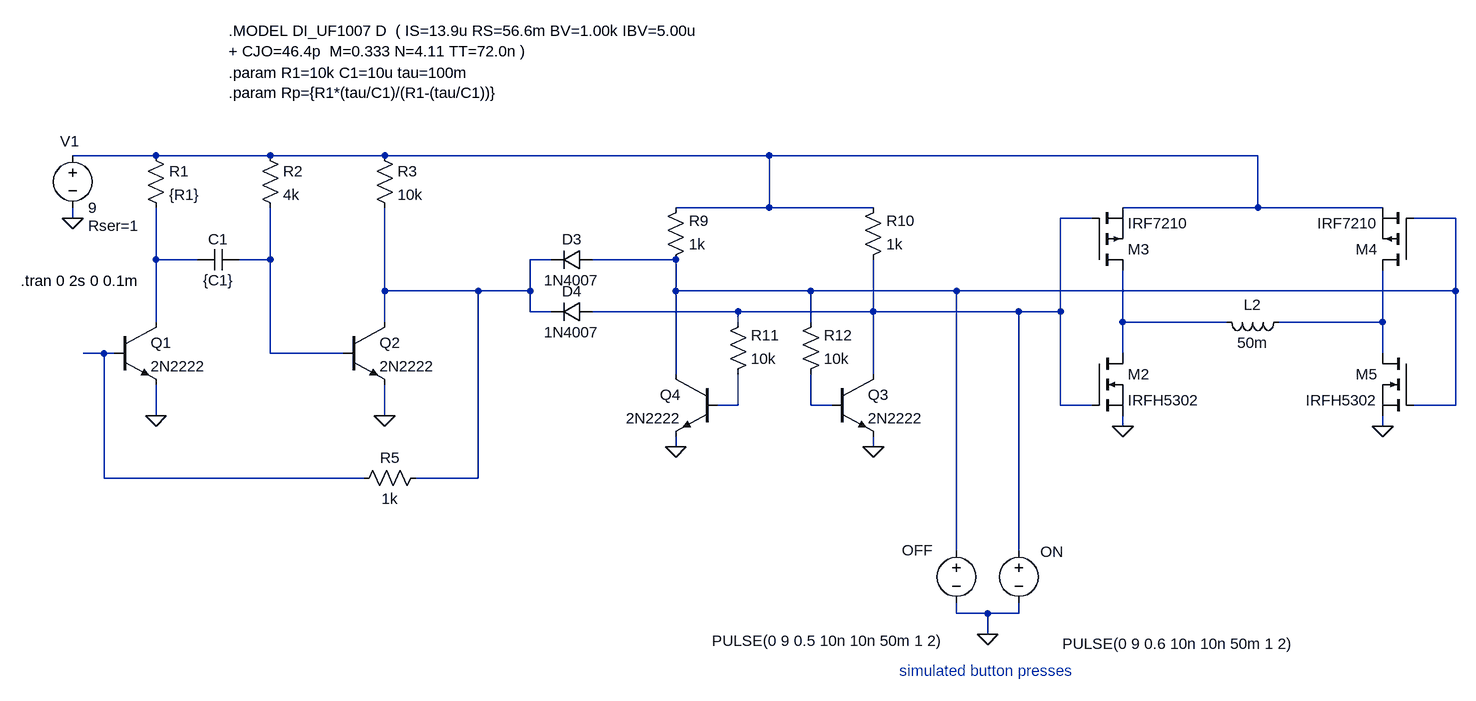
[diagram p0: schematic latching_solenoid_controller_h_bridge.asc]
latching_solenoid_controller_h_bridge.asc, the LTspice schematic file:
Version 4
SHEET 1 2232 1316
WIRE 32 64 -96 64
WIRE 208 64 32 64
WIRE 384 64 208 64
WIRE 976 64 384 64
WIRE 1728 64 976 64
WIRE 976 144 976 64
WIRE 976 144 832 144
WIRE 1136 144 976 144
WIRE 1728 144 1728 64
WIRE 1728 144 1520 144
WIRE 1920 144 1728 144
WIRE -96 160 -96 144
WIRE 1472 160 1424 160
WIRE 2032 160 1968 160
WIRE 32 224 32 144
WIRE 96 224 32 224
WIRE 208 224 208 144
WIRE 208 224 160 224
WIRE 640 224 608 224
WIRE 832 224 704 224
WIRE 384 272 384 144
WIRE 528 272 384 272
WIRE 608 272 608 224
WIRE 608 272 528 272
WIRE 832 272 832 224
WIRE 1040 272 832 272
WIRE 1264 272 1040 272
WIRE 2032 272 2032 160
WIRE 2032 272 1264 272
WIRE 608 304 608 272
WIRE 640 304 608 304
WIRE 928 304 704 304
WIRE 1136 304 1136 224
WIRE 1136 304 928 304
WIRE 1360 304 1136 304
WIRE 1424 304 1424 160
WIRE 1424 304 1360 304
WIRE 32 320 32 224
WIRE 384 320 384 272
WIRE 928 320 928 304
WIRE 1040 320 1040 272
WIRE 1520 320 1520 240
WIRE 1680 320 1520 320
WIRE 1920 320 1920 240
WIRE 1920 320 1760 320
WIRE -48 368 -80 368
WIRE -32 368 -48 368
WIRE 208 368 208 224
WIRE 320 368 208 368
WIRE 1520 368 1520 320
WIRE 1920 368 1920 320
WIRE 832 400 832 272
WIRE 1136 400 1136 304
WIRE 928 448 928 400
WIRE 928 448 896 448
WIRE 1040 448 1040 400
WIRE 1072 448 1040 448
WIRE 1424 448 1424 304
WIRE 1472 448 1424 448
WIRE 2032 448 2032 272
WIRE 2032 448 1968 448
WIRE 32 464 32 416
WIRE 384 464 384 416
WIRE 1520 480 1520 464
WIRE 1920 480 1920 464
WIRE 832 512 832 496
WIRE 1136 512 1136 496
WIRE -48 560 -48 368
WIRE 352 560 -48 560
WIRE 528 560 528 272
WIRE 528 560 432 560
WIRE 1264 672 1264 272
WIRE 1360 672 1360 304
WIRE 1264 768 1264 752
WIRE 1312 768 1264 768
WIRE 1360 768 1360 752
WIRE 1360 768 1312 768
WIRE 1312 800 1312 768
FLAG 32 464 0
FLAG 384 464 0
FLAG -96 160 0
FLAG 1520 480 0
FLAG 1312 800 0
FLAG 832 512 0
FLAG 1136 512 0
FLAG 1920 480 0
SYMBOL res 16 48 R0
SYMATTR InstName R1
SYMATTR Value {R1}
SYMBOL res 192 48 R0
SYMATTR InstName R2
SYMATTR Value 4k
SYMBOL res 368 48 R0
SYMATTR InstName R3
SYMATTR Value 10k
SYMBOL npn -32 320 R0
SYMATTR InstName Q1
SYMATTR Value 2N2222
SYMBOL npn 320 320 R0
SYMATTR InstName Q2
SYMATTR Value 2N2222
SYMBOL cap 160 208 R90
WINDOW 0 0 32 VBottom 2
WINDOW 3 32 32 VTop 2
SYMATTR InstName C1
SYMATTR Value {C1}
SYMBOL voltage -96 48 R0
WINDOW 123 0 0 Left 0
WINDOW 39 24 124 Left 2
WINDOW 0 -19 -6 Left 2
SYMATTR SpiceLine Rser=1
SYMATTR InstName V1
SYMATTR Value 9
SYMBOL voltage 1264 656 R0
WINDOW 123 0 0 Left 0
WINDOW 39 0 0 Left 0
WINDOW 0 -84 15 Left 2
WINDOW 3 -376 154 Left 2
SYMATTR InstName OFF
SYMATTR Value PULSE(0 9 0.5 10n 10n 50m 1 2)
SYMBOL res 448 544 R90
WINDOW 0 0 56 VBottom 2
WINDOW 3 32 56 VTop 2
SYMATTR InstName R5
SYMATTR Value 1k
SYMBOL ind 1776 304 R90
WINDOW 0 5 56 VBottom 2
WINDOW 3 32 56 VTop 2
SYMATTR InstName L2
SYMATTR Value 50m
SYMATTR SpiceLine Rser=10
SYMBOL nmos 1472 368 R0
SYMATTR InstName M2
SYMATTR Value IRFH5302
SYMBOL pmos 1472 240 M180
SYMATTR InstName M3
SYMATTR Value IRF7210
SYMBOL pmos 1968 240 R180
SYMATTR InstName M4
SYMATTR Value IRF7210
SYMBOL nmos 1968 368 M0
SYMATTR InstName M5
SYMATTR Value IRFH5302
SYMBOL voltage 1360 656 M0
WINDOW 123 0 0 Left 0
WINDOW 39 0 0 Left 0
WINDOW 0 -69 17 Left 2
WINDOW 3 -425 159 Left 2
SYMATTR InstName ON
SYMATTR Value PULSE(0 9 0.6 10n 10n 50m 1 2)
SYMBOL npn 1072 400 R0
SYMATTR InstName Q3
SYMATTR Value 2N2222
SYMBOL npn 896 400 M0
SYMATTR InstName Q4
SYMATTR Value 2N2222
SYMBOL res 816 240 M180
WINDOW 0 36 76 Left 2
WINDOW 3 36 40 Left 2
SYMATTR InstName R9
SYMATTR Value 1k
SYMBOL res 1120 240 M180
WINDOW 0 36 76 Left 2
WINDOW 3 36 40 Left 2
SYMATTR InstName R10
SYMATTR Value 1k
SYMBOL res 912 416 M180
WINDOW 0 36 76 Left 2
WINDOW 3 36 40 Left 2
SYMATTR InstName R11
SYMATTR Value 10k
SYMBOL res 1024 416 M180
WINDOW 0 36 76 Left 2
WINDOW 3 36 40 Left 2
SYMATTR InstName R12
SYMATTR Value 10k
SYMBOL diode 704 208 R90
WINDOW 0 0 32 VBottom 2
WINDOW 3 32 32 VTop 2
SYMATTR InstName D3
SYMATTR Value 1N4007
SYMBOL diode 704 288 R90
WINDOW 0 0 32 VBottom 2
WINDOW 3 32 32 VTop 2
SYMATTR InstName D4
SYMATTR Value 1N4007
TEXT 144 -64 Left 2 !.param R1=10k C1=10u tau=100m\n.param Rp={R1*(tau/C1)/(R1-(tau/C1))}
TEXT -176 256 Left 2 !.tran 0 2s 0 0.1m
TEXT 144 -128 Left 2 !.MODEL DI_UF1007 D  ( IS=13.9u RS=56.6m BV=1.00k IBV=5.00u\n+ CJO=46.4p  M=0.333 N=4.11 TT=72.0n )
TEXT 1176 856 Left 2 ;simulated button presses

The netlist it stands for:
* latching_solenoid_controller_h_bridge.asc
R1 N001 N004 {R1}
R2 N001 N005 4k
R3 N001 N006 10k
Q1 N004 N009 0 0 2N2222
Q2 N006 N005 0 0 2N2222
C1 N005 N004 {C1}
V1 N001 0 9 Rser=1
V§OFF N003 0 PULSE(0 9 0.5 10n 10n 50m 1 2)
R5 N006 N009 1k
L2 N008 N007 50m Rser=10
M2 N007 N002 0 0 IRFH5302
M3 N007 N002 N001 N001 IRF7210
M4 N008 N003 N001 N001 IRF7210
M5 N008 N003 0 0 IRFH5302
V§ON N002 0 PULSE(0 9 0.6 10n 10n 50m 1 2)
Q3 N002 N011 0 0 2N2222
Q4 N003 N010 0 0 2N2222
R9 N003 N001 1k
R10 N002 N001 1k
R11 N010 N002 10k
R12 N011 N003 10k
D3 N003 N006 1N4007
D4 N002 N006 1N4007
.model D D
.lib standard.dio
.model NPN NPN
.model PNP PNP
.lib standard.bjt
.model NMOS NMOS
.model PMOS PMOS
.lib standard.mos
.param R1=10k C1=10u tau=100m
.param Rp={R1*(tau/C1)/(R1-(tau/C1))}
.tran 0 2s 0 0.1m
.MODEL DI_UF1007 D  ( IS=13.9u RS=56.6m BV=1.00k IBV=5.00u
+ CJO=46.4p  M=0.333 N=4.11 TT=72.0n )
* simulated button presses
.backanno
.end